# Altium project BMS_AFE.PrjPcb (part 2 of 3)

## Sheet BMS AFE - Communications.SchDoc: Title
size B; Organization: Midnight Sun Solar Rayce Car Team; Address1: University of Waterloo; Address2: 200 University Ave W; Address3: Waterloo, ON, Canada; Address4: N2L 3E9; DocumentNumber: 6; SheetNumber: 6; SheetTotal: 7; Website: www.uwmidsun.com; ProjectName: ProjectName
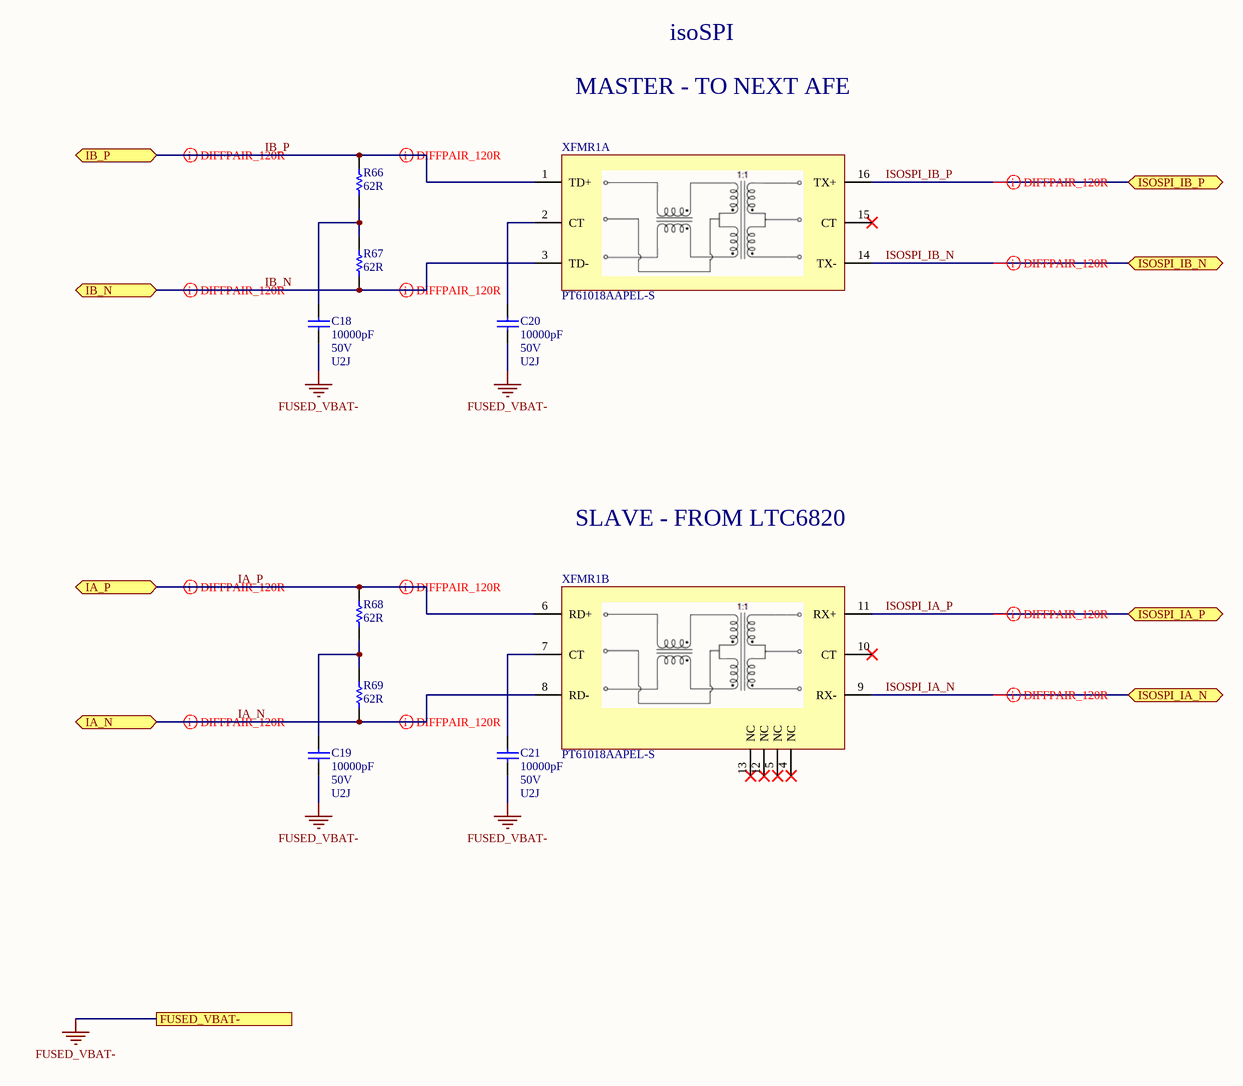
[diagram p4: BMS AFE - Communications.SchDoc]

### Parts
C18  Capacitance: 10000pF  Voltage: 50V  Temperature Coefficient: U2J  [CAP, 0603]  (hidden comment: CAP CER 10nF 50V 5% X7R 0603)
C19  Capacitance: 10000pF  Voltage: 50V  Temperature Coefficient: U2J  [CAP, 0603]  (hidden comment: CAP CER 10nF 50V 5% X7R 0603)
C20  Capacitance: 10000pF  Voltage: 50V  Temperature Coefficient: U2J  [CAP, 0603]  (hidden comment: CAP CER 10nF 50V 5% X7R 0603)
C21  Capacitance: 10000pF  Voltage: 50V  Temperature Coefficient: U2J  [CAP, 0603]  (hidden comment: CAP CER 10nF 50V 5% X7R 0603)
R66  62R  [RES, 0603]
R67  62R  [RES, 0603]
R68  62R  [RES, 0603]
R69  62R  [RES, 0603]
XFMR1  MFG_PN: PT61018AAPEL-S  [IC, PULSE XFMR 1CT:1CT 350UH SMD]  (hidden comment: IC PULSE XFMR 1CT:1CT 350UH SMD)  (parts A,B of 2)

### Ports
FUSED_VBAT-, IA_N (bidir), IA_P (bidir), IB_N (bidir), IB_P (bidir), ISOSPI_IA_N (bidir), ISOSPI_IA_P (bidir), ISOSPI_IB_N (bidir), ISOSPI_IB_P (bidir)

### Nets
FUSED_VBAT-: C18.2 C19.2 C20.2 C21.2 ; port FUSED_VBAT-
IA_N: R69.2 XFMR1.8(RD-) ; port IA_N
IA_P: R68.1 XFMR1.6(RD+) ; port IA_P
IB_N: R67.2 XFMR1.3(TD-) ; port IB_N
IB_P: R66.1 XFMR1.1(TD+) ; port IB_P
ISOSPI_IA_N: XFMR1.9(RX-) ; port ISOSPI_IA_N
ISOSPI_IA_P: XFMR1.11(RX+) ; port ISOSPI_IA_P
ISOSPI_IB_N: XFMR1.14(TX-) ; port ISOSPI_IB_N
ISOSPI_IB_P: XFMR1.16(TX+) ; port ISOSPI_IB_P
NetC18_1: C18.1 R66.2 R67.1
NetC19_1: C19.1 R68.2 R69.1
NetC20_1: C20.1 XFMR1.2(CT)
NetC21_1: C21.1 XFMR1.7(CT)

Not connected (* = marked no-connect by the designer): XFMR1 4(NC)* 5(NC)* 10(CT)* 12(NC)* 13(NC)* 15(CT)*

### Layout directives
differential pair: IA_N, IA_P, IB_N, IB_P, ISOSPI_IA_N, ISOSPI_IA_P, ISOSPI_IB_N, ISOSPI_IB_P

### Notes on the sheet
- MASTER - TO NEXT AFE
- isoSPI
- SLAVE - FROM LTC6820
- PROJECT
- DOCUMENT
- DRAWN BY
- LAST MODIFIED
- PART NUMBER
- REVISION
- SHEET
- VARIANT
- OF
- Engineering 5 - 1002
  University of Waterloo
  (519) 888-4567 x32978
  hardware@uwmidsun.com

### Library data of the parts
C18-C21 = CAP CER 10nF 50V 5% X7R 0603: 10000pF ±5% 50V Ceramic Capacitor U2J 0603 (1608 Metric); Manufacturer 1: KEMET; Manufacturer Part Number 1: C0603C103J5JAC7867; Supplier 1: Digi-Key; Supplier Part Number 1: 399-13384-1-ND; Packaging: Cut Tape (CT); Part Status: Active; Operating Temperature: -55°C ~ 125°C; Ratings: -; Failure Rate: -; Mounting Type: Surface Mount, MLCC; Package / Case: 0603 (1608 Metric); Size / Dimension: 0.063" L x 0.032" W (1.60mm x 0.80mm); Height - Seated (Max): -; Thickness (Max): 0.034" (0.87mm); Lead Spacing: -; Lead Style: -; ComponentLink1URL: http://www.kemet.com/docfinder?Partnumber=C0603C103J5JAC7867; ComponentLink1Description: http://www.kemet.com/docfinder?Partnumber=C0603C103J5JAC7867; Tolerance: ±5%
R66-R69 = RES 62 OHM 0.1% 1/10W 0603: 62 Ohms ±0.1% 0.1W, 1/10W Chip Resistor 0603 (1608 Metric) Automotive AEC-Q200 Thin Film; Manufacturer: Panasonic Electronic Components; Manufacturer Part Number: ERA-3AEB620V; Temperature Coefficient: ±25ppm/°C; Supplier 1: Digi-Key; RoHS: RoHS Compliant; Category: Resistors; Stock 1: 10320; Pricing 1: 1=0.52, 10=0.447, 100=0.1748, 1000=0.07317, 2500=0.06708 (CAD); Packaging: Cut Tape (CT); Part Status: Active; Tolerance: ±0.1%; Power (Watts): 0.1W, 1/10W; Composition: Thin Film; Features: Automotive AEC-Q200; Operating Temperature: -55°C ~ 155°C; Package / Case: 0603 (1608 Metric); Supplier Device Package: 0603; Size / Dimension: 0.063" L x 0.032" W (1.60mm x 0.80mm); Height - Seated (Max): 0.022" (0.55mm); Failure Rate: -; ComponentLink1URL: https://industrial.panasonic.com/cdbs/www-data/pdf/RDM0000/AOA0000C307.pdf; ComponentLink1Description: https://industrial.panasonic.com/cdbs/www-data/pdf/RDM0000/AOA0000C307.pdf; Supplier Part Number 1: P62DBCT-ND
XFMR1 = IC PULSE XFMR 1CT:1CT 350UH SMD: PULSE XFMR 1CT:1CT 350UH SMD; Manufacturer: Bourns Inc.; Isolation Voltage: 1.5kVrms; Supplier: Digikey; Supplier_PN: PT61018AAPEL-SCT-ND; Inductance: 350uH; Supplier 1: Digi-Key; Supplier Part Number 1: PT61018AAPEL-SCT-ND

## Sheet BMS AFE - Thermistors.SchDoc: Title
size B; Organization: Midnight Sun Solar Rayce Car Team; Address1: University of Waterloo; Address2: 200 University Ave W; Address3: Waterloo, ON, Canada; Address4: N2L 3E9; DocumentNumber: 7; SheetNumber: 7; SheetTotal: 7; Website: www.uwmidsun.com; ProjectName: ProjectName
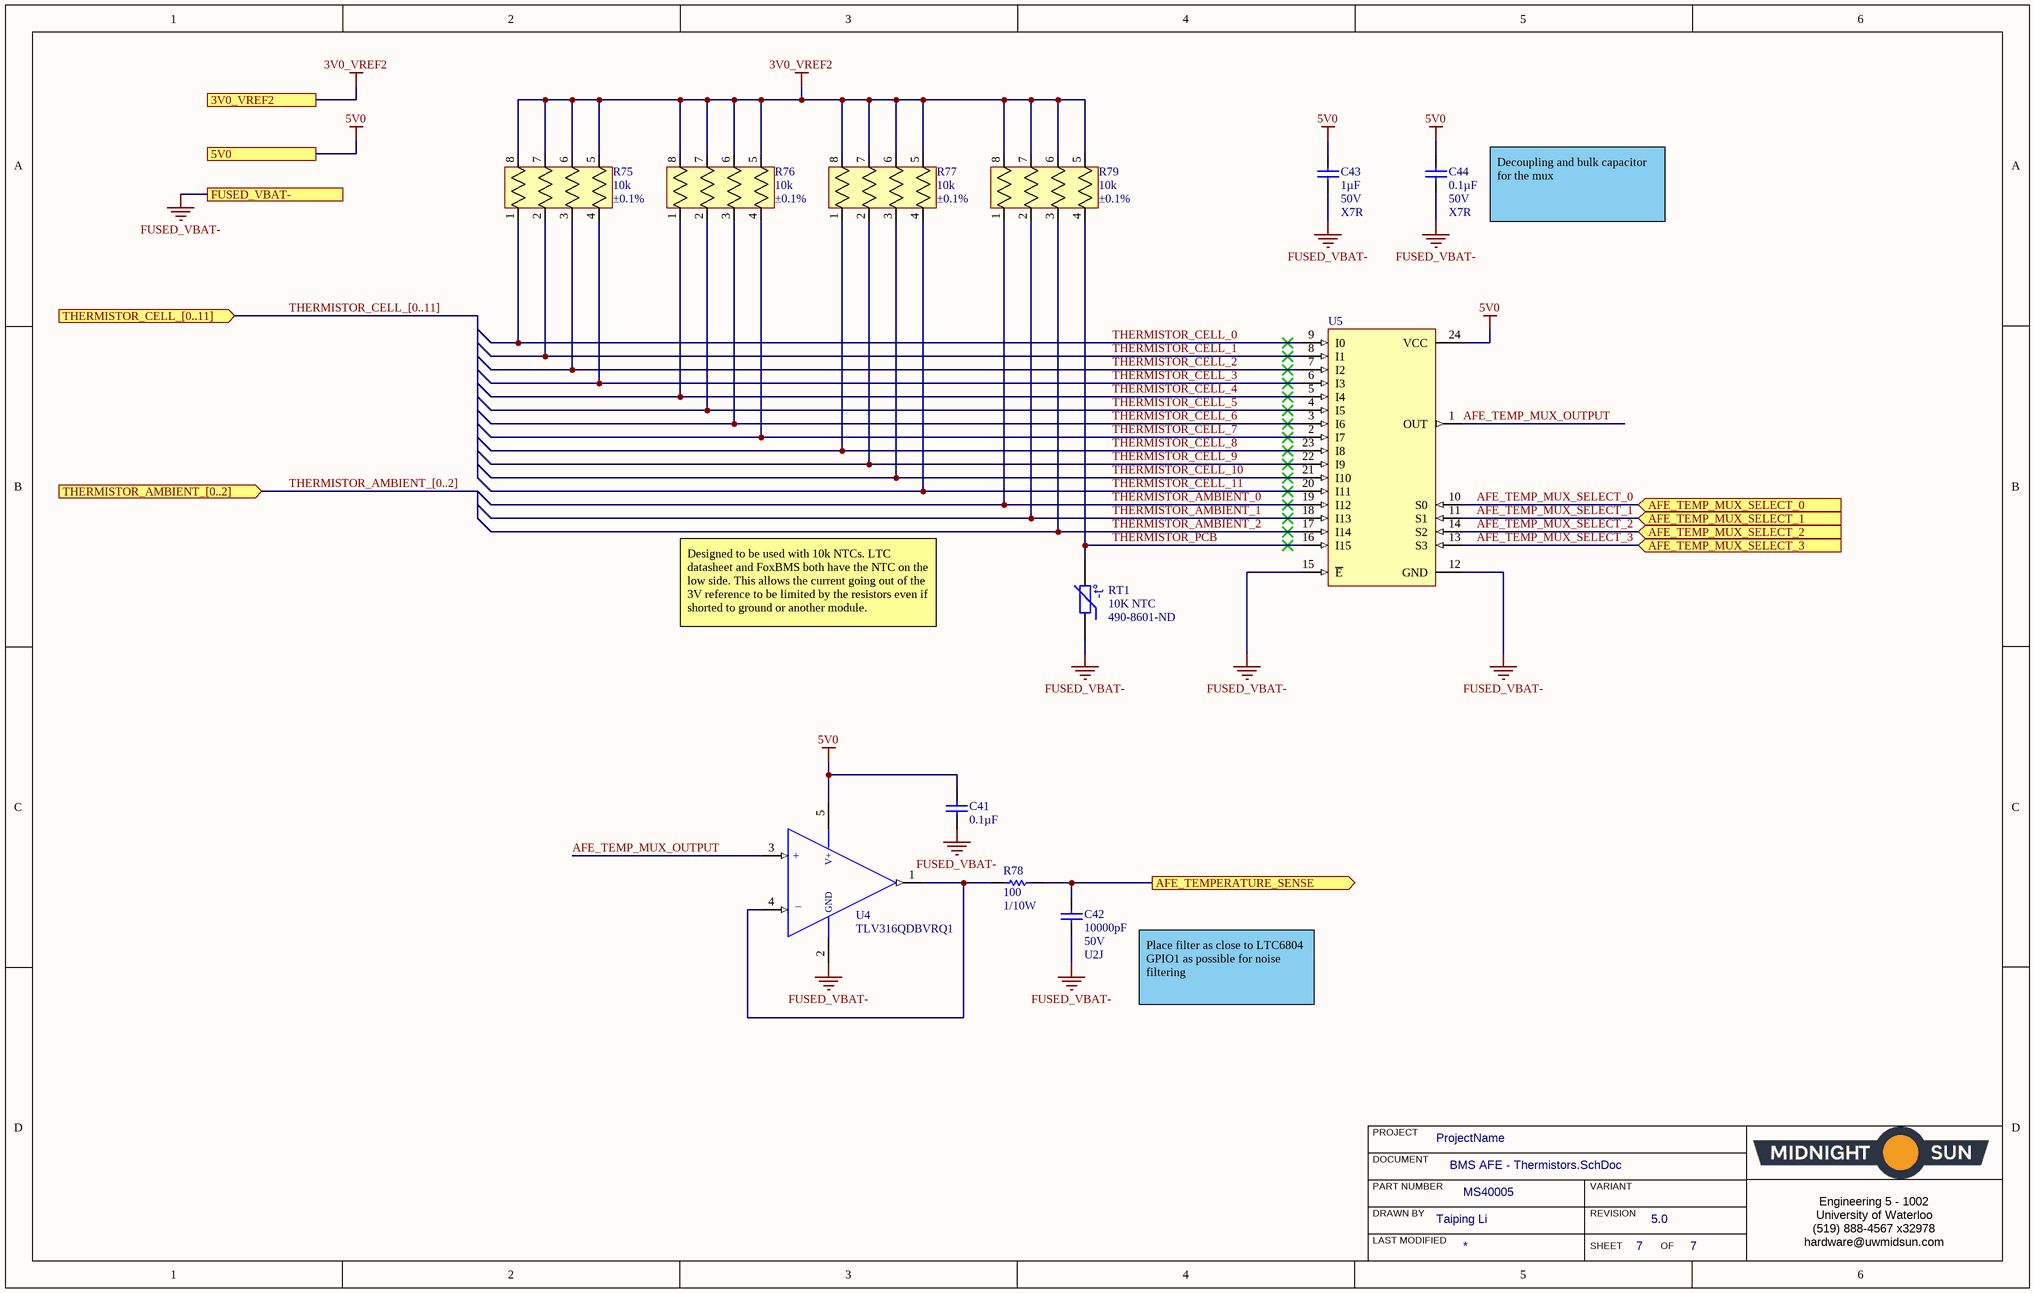
[diagram p5: BMS AFE - Thermistors.SchDoc]

### Parts
C41  Capacitance: 0.1µF  [CAP, 0603]  (hidden comment: CAP CER 0.1UF 50V 10% X7R 0603)
C42  Capacitance: 10000pF  Voltage: 50V  Temperature Coefficient: U2J  [CAP, 0603]  (hidden comment: CAP CER 10nF 50V 5% X7R 0603)
C43  Capacitance: 1µF  Voltage: 50V  Temperature Coefficient: X7R  [CAP, 0603]  (hidden comment: CAP CER 1UF 50V 10% X7R 0603)
C44  Capacitance: 0.1µF  Voltage: 50V  Temperature Coefficient: X7R  [CAP, 0603]  (hidden comment: CAP CER 0.1UF 50V 10% X7R 0603)
R75  Resistance (Ohms): 10k  Tolerance: ±0.1%  [RES ARRAY 4RES 1206]  (hidden comment: RES ARRAY 10K OHM 0.1% 4RES 1206)
R76  Resistance (Ohms): 10k  Tolerance: ±0.1%  [RES ARRAY 4RES 1206]  (hidden comment: RES ARRAY 10K OHM 0.1% 4RES 1206)
R77  Resistance (Ohms): 10k  Tolerance: ±0.1%  [RES ARRAY 4RES 1206]  (hidden comment: RES ARRAY 10K OHM 0.1% 4RES 1206)
R78  Resistance: 100  Power: 1/10W  [RES, 0603]  (hidden comment: RES 100 OHM 1% 1/10W 0603)
R79  Resistance (Ohms): 10k  Tolerance: ±0.1%  [RES ARRAY 4RES 1206]  (hidden comment: RES ARRAY 10K OHM 0.1% 4RES 1206)
RT1  10K NTC  Supplier Part Number 1: 490-8601-ND  [NTC THERMISTOR BEAD]
U4  Manufacturer Part Number 1: TLV316QDBVRQ1  [IC OP AMP GP RR 10MHZ SOT-23-5]  (hidden comment: IC OP AMP GEN PURPOSE RR 10MHZ SOT-23-5)
U5  IC MUX/DEMUX 1X16 24SSOP  [SOP127P1030X265-24N]  (value not drawn)

### Ports
3V0_VREF2, 5V0, AFE_TEMP_MUX_SELECT_0 (in), AFE_TEMP_MUX_SELECT_1 (in), AFE_TEMP_MUX_SELECT_2 (in), AFE_TEMP_MUX_SELECT_3 (in), AFE_TEMPERATURE_SENSE (out), FUSED_VBAT-, THERMISTOR_AMBIENT_[0..2] (in), THERMISTOR_CELL_[0..11] (in)

### Nets
3V0_VREF2: R75.5 R75.6 R75.7 R75.8 R76.5 R76.6 R76.7 R76.8 R77.5 R77.6 R77.7 R77.8 R79.5 R79.6 R79.7 R79.8 ; port 3V0_VREF2
5V0: C41.1 C43.1 C44.1 U4.5(VDD) U5.24(VCC) ; port 5V0
FUSED_VBAT-: C41.2 C42.2 C43.2 C44.2 RT1.1 U4.2(VSS) U5.12(GND) U5.15(~{E}) ; port FUSED_VBAT-
AFE_TEMP_MUX_OUTPUT: U4.3(+IN) U5.1(OUT)
AFE_TEMP_MUX_SELECT_0: U5.10(S0) ; port AFE_TEMP_MUX_SELECT_0
AFE_TEMP_MUX_SELECT_1: U5.11(S1) ; port AFE_TEMP_MUX_SELECT_1
AFE_TEMP_MUX_SELECT_2: U5.14(S2) ; port AFE_TEMP_MUX_SELECT_2
AFE_TEMP_MUX_SELECT_3: U5.13(S3) ; port AFE_TEMP_MUX_SELECT_3
THERMISTOR_AMBIENT_0: R79.1 U5.19(I12)
THERMISTOR_AMBIENT_1: R79.2 U5.18(I13)
THERMISTOR_AMBIENT_2: R79.3 U5.17(I14)
THERMISTOR_CELL_0: R75.1 U5.9(I0)
THERMISTOR_CELL_1: R75.2 U5.8(I1)
THERMISTOR_CELL_2: R75.3 U5.7(I2)
THERMISTOR_CELL_3: R75.4 U5.6(I3)
THERMISTOR_CELL_4: R76.1 U5.5(I4)
THERMISTOR_CELL_5: R76.2 U5.4(I5)
THERMISTOR_CELL_6: R76.3 U5.3(I6)
THERMISTOR_CELL_7: R76.4 U5.2(I7)
THERMISTOR_CELL_8: R77.1 U5.23(I8)
THERMISTOR_CELL_9: R77.2 U5.22(I9)
THERMISTOR_CELL_10: R77.3 U5.21(I10)
THERMISTOR_CELL_11: R77.4 U5.20(I11)
THERMISTOR_PCB: R79.4 RT1.2 U5.16(I15)
NetC42_1: C42.1 R78.2 ; port AFE_TEMPERATURE_SENSE
NetR78_1: R78.1 U4.1(OUTPUT) U4.4(-IN)

### Buses and harness runs
bus THERMISTOR_AMBIENT_[0..2] = port THERMISTOR_AMBIENT_[0..2]
bus THERMISTOR_CELL_[0..11] = port THERMISTOR_CELL_[0..11]

### Notes on the sheet
- Decoupling and bulk capacitor for the mux
- Designed to be used with 10k NTCs. LTC datasheet and FoxBMS both have the NTC on the low side. This allows the current going out of the 3V reference to be limited by the resistors even if shorted to ground or another module.
- Place filter as close to LTC6804 GPIO1 as possible for noise filtering
- PROJECT
- DOCUMENT
- DRAWN BY
- LAST MODIFIED
- PART NUMBER
- REVISION
- SHEET
- VARIANT
- OF
- Engineering 5 - 1002
  University of Waterloo
  (519) 888-4567 x32978
  hardware@uwmidsun.com
- (in symbol IC OP AMP GEN PURPOSE RR 10MHZ SOT-23-5) V+; +; GND; _
- (in symbol NTC THERMISTOR 10K 1% BEAD) -t°

### Library data of the parts
C41 C44 = CAP CER 0.1UF 50V 10% X7R 0603: 0.10µF ±10% 50V Ceramic Capacitor X7R 0603 (1608 Metric); Manufacturer 1: AVX Corporation; Manufacturer Part Number 1: 06035C104KAT2A; Supplier 1: Digi-Key; Supplier Part Number 1: 478-5052-1-ND; Packaging: Cut Tape (CT); Part Status: Active; Operating Temperature: -55°C ~ 125°C; Ratings: -; Mounting Type: Surface Mount, MLCC; Package / Case: 0603 (1608 Metric); Size / Dimension: 0.063" L x 0.032" W (1.60mm x 0.81mm); Height - Seated (Max): -; Thickness (Max): 0.035" (0.90mm); Lead Spacing: -; Lead Style: -; ComponentLink1URL: http://datasheets.avx.com/X7RDielectric.pdf; ComponentLink1Description: http://datasheets.avx.com/X7RDielectric.pdf; Tolerance: ±10%
  C41: Voltage: 50V; Temperature Coefficient: X7R
C42 = CAP CER 10nF 50V 5% X7R 0603: as C18 on sheet BMS AFE - Communications; Supplier 1: Digi-Key; Supplier Part Number 1: 399-13384-1-ND; Packaging: Cut Tape (CT); Part Status: Active; Operating Temperature: -55°C ~ 125°C; Ratings: -; Failure Rate: -; Mounting Type: Surface Mount, MLCC; Package / Case: 0603 (1608 Metric); Size / Dimension: 0.063" L x 0.032" W (1.60mm x 0.80mm); Height - Seated (Max): -; Thickness (Max): 0.034" (0.87mm); Lead Spacing: -; Lead Style: -; ComponentLink1URL: http://www.kemet.com/docfinder?Partnumber=C0603C103J5JAC7867; ComponentLink1Description: http://www.kemet.com/docfinder?Partnumber=C0603C103J5JAC7867; Tolerance: ±5%
C43 = CAP CER 1UF 50V 10% X7R 0603: as C2 on sheet BMS AFE - AFE; Supplier 1: Digi-Key; Supplier Part Number 1: 587-3247-1-ND; Packaging: Cut Tape (CT); Part Status: Active; Operating Temperature: -55°C ~ 125°C; Ratings: -; Mounting Type: Surface Mount, MLCC; Package / Case: 0603 (1608 Metric); Size / Dimension: 0.063" L x 0.031" W (1.60mm x 0.80mm); Height - Seated (Max): -; Thickness (Max): 0.037" (0.95mm); Lead Spacing: -; Lead Style: -; ComponentLink1URL: http://www.yuden.co.jp/productdata/catalog/en/mlcc_all_e.pdf; ComponentLink1Description: http://www.yuden.co.jp/productdata/catalog/en/mlcc_all_e.pdf; Tolerance: ±10%
R75-R77 R79 = RES ARRAY 10K OHM 0.1% 4RES 1206: 10k Ohm ±0.1% 100mW Power Per Element Isolated 4 Resistor Network/Array ±25ppm/°C 1206 (3216 Metric), Convex, Long Side Terminals; Manufacturer: Vishay Beyschlag; Manufacturer Part Number: ACASA1002S1002P100; Number of Resistors: 4; Resistor Matching Ratio: ±0.05%; Resistor-Ratio-Drift: ±15 ppm/°C; Supplier 1: Digi-Key; RoHS: RoHS Compliant; Category: Resistors; Stock 1: 18780; Pricing 1: 1=1.19, 10=0.99, 25=0.8484, 50=0.7636, 100=0.6647, 250=0.59392, 500=0.4808 (CAD); Packaging: Cut Tape (CT); Part Status: Active; Circuit Type: Isolated; Power Per Element: 100mW; Temperature Coefficient: ±25ppm/°C; Operating Temperature: -55°C ~ 125°C; Applications: Voltage Divider (TCR Matched); Mounting Type: Surface Mount; Package / Case: 1206 (3216 Metric), Convex, Long Side Terminals; Supplier Device Package: 0612; Size / Dimension: 0.126" L x 0.059" W (3.20mm x 1.50mm); Height - Seated (Max): 0.022" (0.55mm); ComponentLink1URL: http://www.vishay.com/docs/28751/acasprec.pdf; ComponentLink1Description: http://www.vishay.com/docs/28751/acasprec.pdf; Supplier Part Number 1: 749-1023-1-ND
R78 = RES 100 OHM 1% 1/10W 0603: 100 Ohm ±1% 0.1W, 1/10W Chip Resistor 0603 (1608 Metric) Moisture Resistant Thick Film; Manufacturer 1: Yageo; Manufacturer Part Number 1: RC0603FR-07100RL; Temperature Coefficient: ±100ppm/°C; Supplier 1: Digi-Key; Supplier Part Number 1: 311-100HRCT-ND; Packaging: Cut Tape (CT); Part Status: Active; Composition: Thick Film; Operating Temperature: -55°C ~ 155°C; Package / Case: 0603 (1608 Metric); Supplier Device Package: 0603; Size / Dimension: 0.063" L x 0.031" W (1.60mm x 0.80mm); Height - Seated (Max): 0.022" (0.55mm); Failure Rate: -; ComponentLink1URL: http://www.yageo.com/documents/recent/PYu-RC_Group_51_RoHS_L_7.pdf; ComponentLink1Description: http://www.yageo.com/documents/recent/PYu-RC_Group_51_RoHS_L_7.pdf; Tolerance: ±1%
RT1 = NTC THERMISTOR 10K 1% BEAD: NTC Thermistor 10k Bead; Manufacturer: Murata Electronics North America; Manufacturer Part Number: NXRT15XH103FA1B030; Resistance Tolerance: ±1%; B25/50: 3380K; B25/85: 3434K; B25/100: 3455K; Supplier 1: Digi-Key; RoHS: RoHS Compliant; Category: Sensors, Transducers; Stock 1: 25017; Pricing 1: 1=0.96, 5=0.91, 10=0.792, 25=0.696, 50=0.5784, 100=0.4925, 500=0.42834, 1000=0.3748, 5000=0.33197 (CAD); Packaging: Bulk; Part Status: Active; Resistance in Ohms @ 25°C: 10k; B Value Tolerance: ±1%; B0/50: -; B25/75: -; Operating Temperature: -40°C ~ 125°C; Length - Lead Wire: -; Mounting Type: Through Hole; Package / Case: Bead; ComponentLink1URL: https://www.murata.com/~/media/webrenewal/support/library/catalog/products/thermistor/ntc/r44e.ashx; ComponentLink1Description: https://www.murata.com/~/media/webrenewal/support/library/catalog/products/thermistor/ntc/r44e.ashx
U4 = IC OP AMP GEN PURPOSE RR 10MHZ SOT-23-5: General Purpose Amplifier 1 Circuit Rail-to-Rail SOT-23-5; Manufacturer 1: Texas Instruments; Description 1: IC OP AMP GP RR 10MHZ 5-SOT-23; Number of Circuits: 1; Slew Rate: 6 V/µs; Current - Supply: 400µA; Current - Output / Channel: 50mA; Voltage - Supply, Single/Dual (±): 1.8 V ~ 5.5 V, ±0.9 V ~ 2.75 V; Supplier 1: Digi-Key; Supplier Part Number 1: 296-45323-1-ND; RoHS: RoHS Compliant; Category: Integrated Circuits (ICs); Stock 1: 1747; Pricing 1: 1=1.33, 10=1.185, 100=0.9234, 500=0.76276, 1000=0.60218 (CAD); Packaging: Cut Tape (CT); Part Status: Active; Amplifier Type: General Purpose; Output Type: Rail-to-Rail; -3db Bandwidth: -; Operating Temperature: -40°C ~ 125°C; Mounting Type: Surface Mount; Package / Case: SC-74A, SOT-753; Supplier Device Package: SOT-23-5; ComponentLink1URL: http://www.ti.com/lit/ds/symlink/tlv316-q1.pdf; ComponentLink1Description: http://www.ti.com/lit/ds/symlink/tlv316-q1.pdf
U5 = IC MUX/DEMUX 1X16 24SSOP: 1 Circuit IC Switch 16:1 160 Ohm 24-SOIC; Manufacturer: Texas Instruments; Manufacturer Part Number: CD74HC4067M96; Number of Circuits: 1; Number of Inputs: 16; Max Supply Voltage: 6V; Min Supply Voltage: 2V; Bandwidth: 89MHz; Propagation Delay: 75ns; On-State Resistance: 180R; Turn-On Delay Time: 300ns; Turn-Off Delay Time: 290ns; Logic Function: Demultiplexer,Multiplexer; Operating Supply Current: 8uA; Supply Type: Single; Low Level Output Current: 25mA; Supplier 1: Digi-Key; Supplier Part Number 1: 296-29408-1-ND; Packaging: Tape and Reel; ComponentLink1URL: http://www.ti.com/lit/ds/symlink/cd74hc4067.pdf; ComponentLink1Description: http://www.ti.com/lit/ds/symlink/cd74hc4067.pdf; Stock 1: 10305; Pricing 1: 1 = 0.80000, 10 = 0.70400, 100 = 0.53940, 500 = 0.42642, 1000 = 0.34114 (USD); RoHS: Yes; Mount: Surface Mount; Case/Package: SOIC; Number of Pins: 24; Weight: 0.022025oz; Contact Plating: Matte,Tin; Min Operating Temperature: -55°C; Max Operating Temperature: 125°C; Number of Channels: 1; Number of Outputs: 1; Package Quantity: 2000; Nominal Supply Current: 8uA; Number of Bits: 16; High Level Output Current: 25mA; Length: 15.4mm; Height: 2.35mm; Width: 7.52mm; Radiation Hardening: No; REACH SVHC: No SVHC; Lead Free: Lead Free; ComponentLink2URL: https://www.verical.com/server-webapp/html/getDatasheet?partID=322813&src-supplier=Verical; ComponentLink2Description: https://www.verical.com/server-webapp/html/getDatasheet?partID=322813&src-supplier=Verical; ComponentLink3URL: http://focus.ti.com/lit/ds/symlink/cd74hc4067.pdf?src-supplier=Avnet+Europe; ComponentLink3Description: http://focus.ti.com/lit/ds/symlink/cd74hc4067.pdf?src-supplier=Avnet+Europe; ComponentLink4URL: http://www.ti.com/lit/ds/symlink/cd74hc4067.pdf?src-supplier=Digi-Key; ComponentLink4Description: http://www.ti.com/lit/ds/symlink/cd74hc4067.pdf?src-supplier=Digi-Key

## Sheet BMS AFE - Connectors.SchDoc: Title
size B; Organization: Midnight Sun Solar Rayce Car Team; Address1: University of Waterloo; Address2: 200 University Ave W; Address3: Waterloo, ON, Canada; Address4: N2L 3E9; DocumentNumber: 2; SheetNumber: 2; SheetTotal: 7; Website: www.uwmidsun.com; ProjectName: ProjectName
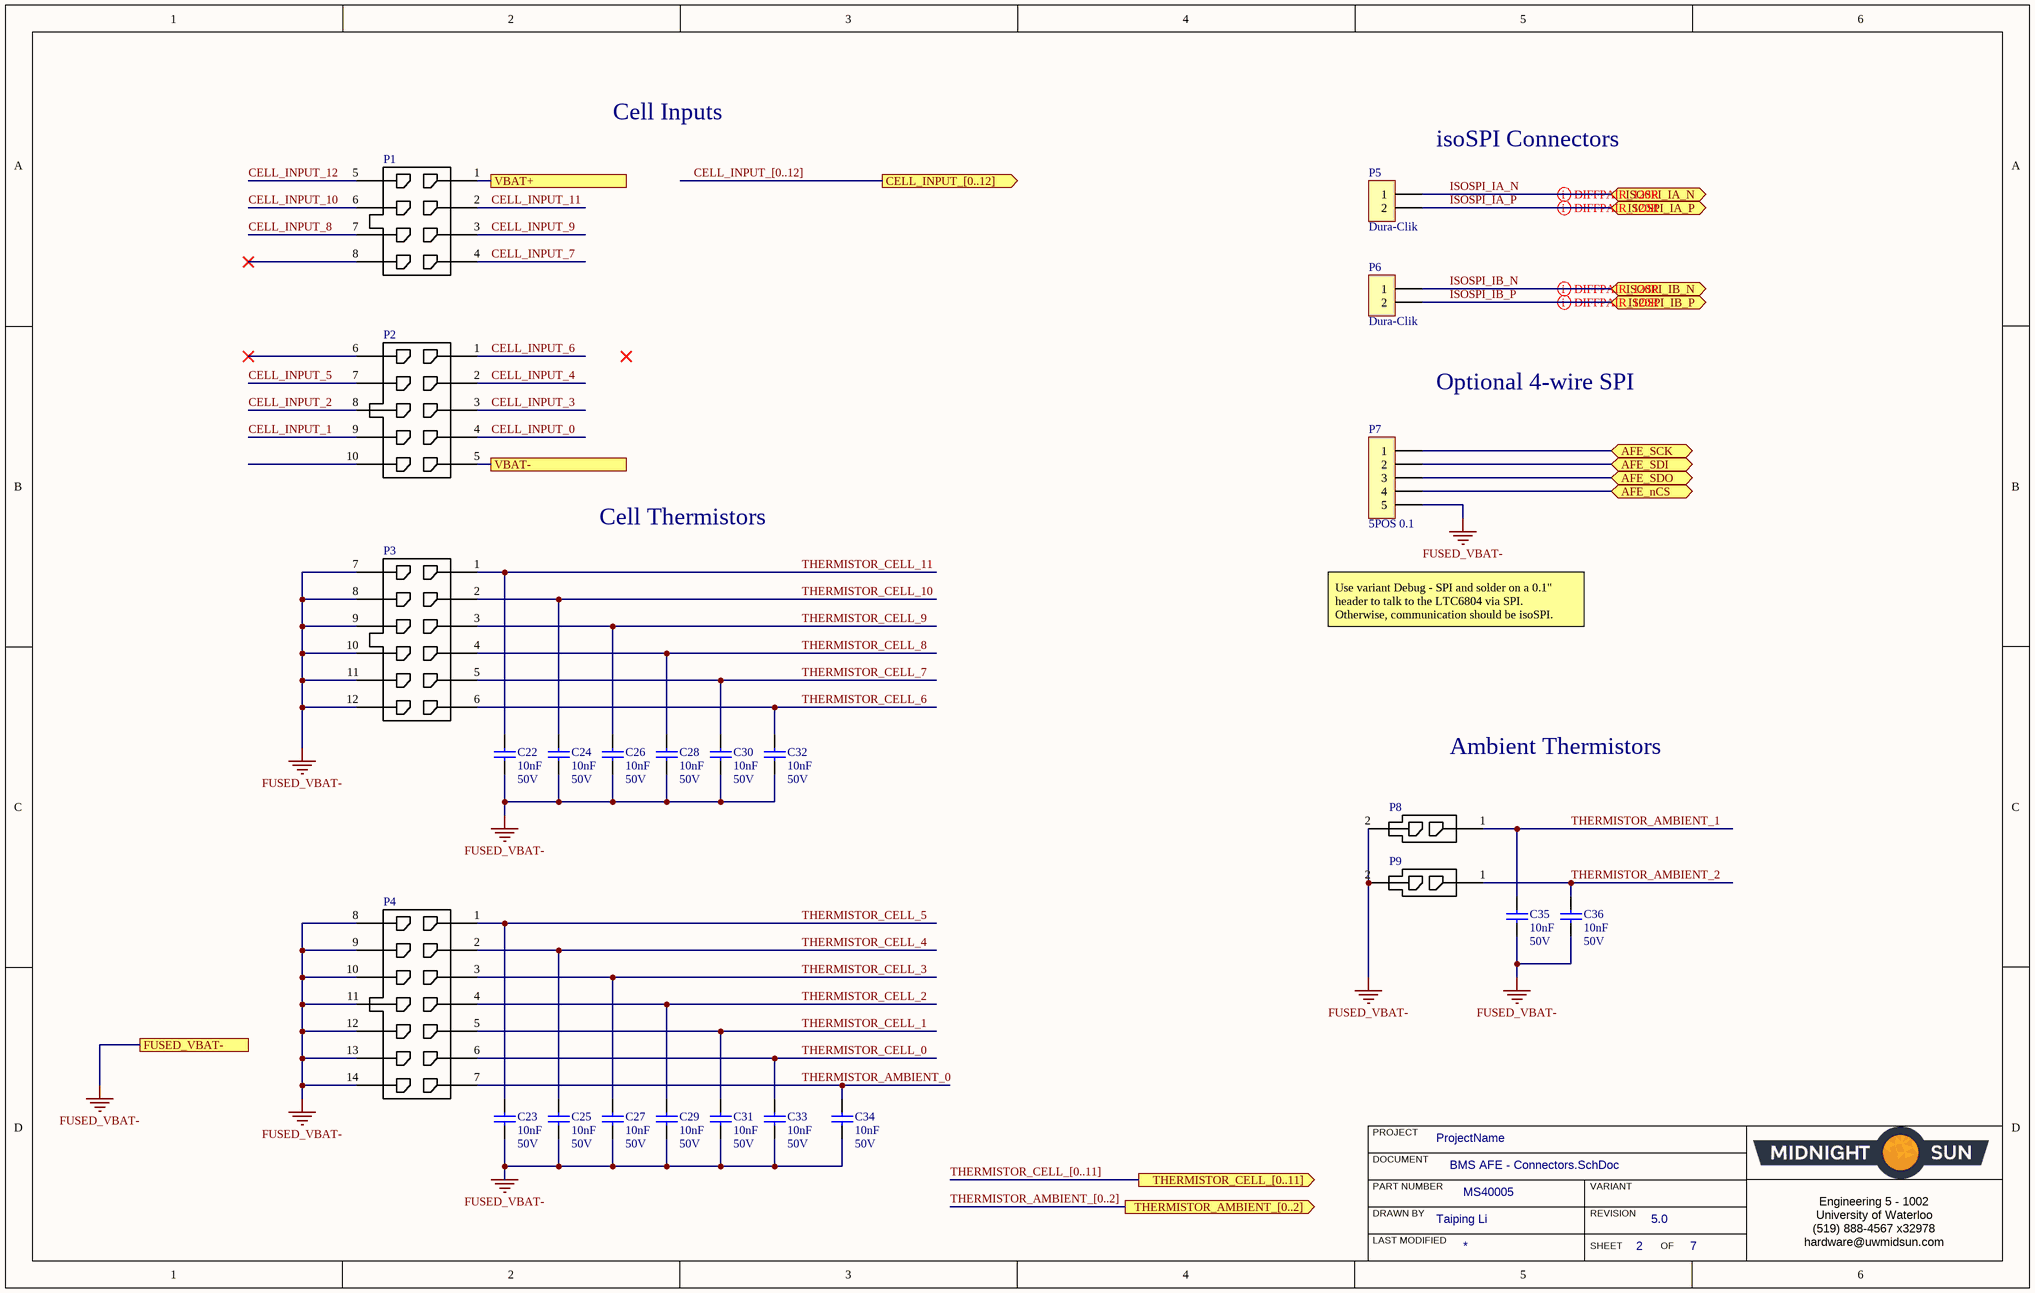
[diagram p6: BMS AFE - Connectors.SchDoc]

### Parts
C22  Capacitance: 10nF  Voltage: 50V  [CAP, 0603]  (hidden comment: CAP CER 10nF 50V 5% X7R 0603)
C23  Capacitance: 10nF  Voltage: 50V  [CAP, 0603]  (hidden comment: CAP CER 10nF 50V 5% X7R 0603)
C24  Capacitance: 10nF  Voltage: 50V  [CAP, 0603]  (hidden comment: CAP CER 10nF 50V 5% X7R 0603)
C25  Capacitance: 10nF  Voltage: 50V  [CAP, 0603]  (hidden comment: CAP CER 10nF 50V 5% X7R 0603)
C26  Capacitance: 10nF  Voltage: 50V  [CAP, 0603]  (hidden comment: CAP CER 10nF 50V 5% X7R 0603)
C27  Capacitance: 10nF  Voltage: 50V  [CAP, 0603]  (hidden comment: CAP CER 10nF 50V 5% X7R 0603)
C28  Capacitance: 10nF  Voltage: 50V  [CAP, 0603]  (hidden comment: CAP CER 10nF 50V 5% X7R 0603)
C29  Capacitance: 10nF  Voltage: 50V  [CAP, 0603]  (hidden comment: CAP CER 10nF 50V 5% X7R 0603)
C30  Capacitance: 10nF  Voltage: 50V  [CAP, 0603]  (hidden comment: CAP CER 10nF 50V 5% X7R 0603)
C31  Capacitance: 10nF  Voltage: 50V  [CAP, 0603]  (hidden comment: CAP CER 10nF 50V 5% X7R 0603)
C32  Capacitance: 10nF  Voltage: 50V  [CAP, 0603]  (hidden comment: CAP CER 10nF 50V 5% X7R 0603)
C33  Capacitance: 10nF  Voltage: 50V  [CAP, 0603]  (hidden comment: CAP CER 10nF 50V 5% X7R 0603)
C34  Capacitance: 10nF  Voltage: 50V  [CAP, 0603]  (hidden comment: CAP CER 10nF 50V 5% X7R 0603)
C35  Capacitance: 10nF  Voltage: 50V  [CAP, 0603]  (hidden comment: CAP CER 10nF 50V 5% X7R 0603)
C36  Capacitance: 10nF  Voltage: 50V  [CAP, 0603]  (hidden comment: CAP CER 10nF 50V 5% X7R 0603)
P1  CONN 8POS MICRO-FIT 3mm  (value not drawn)
P2  CONN 10POS MICRO-FIT 3mm  [CONN, 10POS MICRO-FIT 3mm]  (value not drawn)
P3  CONN 12POS MICRO-FIT 3mm  [CONN, 12POS MICRO-FIT 3mm]  (value not drawn)
P4  CONN 14POS MICRO-FIT 3mm  [CONN, 14POS MICRO-FIT 3mm]  (value not drawn)
P5  Dura-Clik  [CONN, 2POS Dura-Click Vertical]
P6  Dura-Clik  [CONN, 2POS Dura-Click Vertical]
P7  5POS 0.1  [CONN, 5POS HEADR 0.1"]
P8  CONN 2POS MICRO-FIT 3mm  [CONN, 2POS MICRO-FIT]  (value not drawn)
P9  CONN 2POS MICRO-FIT 3mm  [CONN, 2POS MICRO-FIT]  (value not drawn)

### Ports
AFE_nCS (bidir), AFE_SCK (bidir), AFE_SDI (bidir), AFE_SDO (bidir), CELL_INPUT_[0..12] (out), FUSED_VBAT-, ISOSPI_IA_N (bidir), ISOSPI_IA_P (bidir), ISOSPI_IB_N (bidir), ISOSPI_IB_P (bidir), THERMISTOR_AMBIENT_[0..2] (out), THERMISTOR_CELL_[0..11] (out), VBAT+, VBAT-

### Nets
FUSED_VBAT-: C22.2 C23.2 C24.2 C25.2 C26.2 C27.2 C28.2 C29.2 C30.2 C31.2 C32.2 C33.2 C34.2 C35.2 C36.2 P3.7 P3.8 P3.9 P3.10 P3.11 P3.12 P4.8 P4.9 P4.10 P4.11 P4.12 P4.13 P4.14 P7.5 P8.2 P9.2 ; port FUSED_VBAT-
CELL_INPUT_0: P2.4
CELL_INPUT_1: P2.9
CELL_INPUT_2: P2.8
CELL_INPUT_3: P2.3
CELL_INPUT_4: P2.2
CELL_INPUT_5: P2.7
CELL_INPUT_6: P2.1
CELL_INPUT_7: P1.4
CELL_INPUT_8: P1.7
CELL_INPUT_9: P1.3
CELL_INPUT_10: P1.6
CELL_INPUT_11: P1.2
CELL_INPUT_12: P1.5
ISOSPI_IA_N: P5.1 ; port ISOSPI_IA_N
ISOSPI_IA_P: P5.2 ; port ISOSPI_IA_P
ISOSPI_IB_N: P6.1 ; port ISOSPI_IB_N
ISOSPI_IB_P: P6.2 ; port ISOSPI_IB_P
THERMISTOR_AMBIENT_0: C34.1 P4.7
THERMISTOR_AMBIENT_1: C35.1 P8.1
THERMISTOR_AMBIENT_2: C36.1 P9.1
THERMISTOR_CELL_0: C33.1 P4.6
THERMISTOR_CELL_1: C31.1 P4.5
THERMISTOR_CELL_2: C29.1 P4.4
THERMISTOR_CELL_3: C27.1 P4.3
THERMISTOR_CELL_4: C25.1 P4.2
THERMISTOR_CELL_5: C23.1 P4.1
THERMISTOR_CELL_6: C32.1 P3.6
THERMISTOR_CELL_7: C30.1 P3.5
THERMISTOR_CELL_8: C28.1 P3.4
THERMISTOR_CELL_9: C26.1 P3.3
THERMISTOR_CELL_10: C24.1 P3.2
THERMISTOR_CELL_11: C22.1 P3.1
NetF1_1: P2.5 ; port VBAT-
NetF2_1: P1.1 ; port VBAT+
NetP7_1: P7.1 ; port AFE_SCK
NetP7_2: P7.2 ; port AFE_SDI
NetP7_3: P7.3 ; port AFE_SDO
NetP7_4: P7.4 ; port AFE_nCS

Not connected (* = marked no-connect by the designer): P1 8*; P2 6* 10

### Buses and harness runs
bus CELL_INPUT_[0..12] = port CELL_INPUT_[0..12]
bus THERMISTOR_AMBIENT_[0..2] = port THERMISTOR_AMBIENT_[0..2]
bus THERMISTOR_CELL_[0..11] = port THERMISTOR_CELL_[0..11]

### Layout directives
differential pair: ISOSPI_IA_N, ISOSPI_IA_P, ISOSPI_IB_N, ISOSPI_IB_P

### Notes on the sheet
- Cell Inputs
- isoSPI Connectors
- Optional 4-wire SPI
- Cell Thermistors
- Use variant Debug - SPI and solder on a 0.1" header to talk to the LTC6804 via SPI. Otherwise, communication should be isoSPI.
- Ambient Thermistors
- PROJECT
- DOCUMENT
- DRAWN BY
- LAST MODIFIED
- PART NUMBER
- REVISION
- SHEET
- VARIANT
- OF
- Engineering 5 - 1002
  University of Waterloo
  (519) 888-4567 x32978
  hardware@uwmidsun.com

### Library data of the parts
C22-C36 = CAP CER 10nF 50V 5% X7R 0603: as C18 on sheet BMS AFE - Communications; Supplier 1: Digi-Key; Supplier Part Number 1: 399-13384-1-ND; Packaging: Cut Tape (CT); Part Status: Active; Operating Temperature: -55°C ~ 125°C; Ratings: -; Failure Rate: -; Mounting Type: Surface Mount, MLCC; Package / Case: 0603 (1608 Metric); Size / Dimension: 0.063" L x 0.032" W (1.60mm x 0.80mm); Height - Seated (Max): -; Thickness (Max): 0.034" (0.87mm); Lead Spacing: -; Lead Style: -; ComponentLink1URL: http://www.kemet.com/docfinder?Partnumber=C0603C103J5JAC7867; ComponentLink1Description: http://www.kemet.com/docfinder?Partnumber=C0603C103J5JAC7867; Tolerance: ±5%; Temperature Coefficient: U2J
P1 = CONN 8POS MICRO-FIT 3mm: Connector Header Through Hole 6 position 0.118" (3.00mm); Manufacturer: Molex, LLC; Manufacturer Part Number: 0430450827; Number of Positions: 6; Number of Positions Loaded: All; Style: Board to Cable/Wire; Shrouding: Shrouded - 4 Wall; Contact Length - Post: 0.125" (3.18mm); Material Flammability Rating: UL94 V-0; RoHS: RoHS Compliant; Category: Connectors, Interconnects; Packaging: Tray; Part Status: Active; Connector Type: Header; Contact Type: Male Pin; Pitch - Mating: 0.118" (3.00mm); Number of Rows: 2; Row Spacing - Mating: 0.118" (3.00mm); Mounting Type: Through Hole; Termination: Solder; Fastening Type: Locking Ramp; Contact Length - Mating: -; Overall Contact Length: -; Insulation Height: 0.390" (9.91mm); Contact Shape: Square; Contact Finish - Mating: Tin; Contact Finish Thickness - Mating: 60.0µin (1.52µm); Contact Finish - Post: Tin; Contact Material: Brass; Insulation Material: Liquid Crystal Polymer (LCP), Glass Filled; Features: Board Guide; Operating Temperature: -; Ingress Protection: -; Insulation Color: Black; Current Rating: -; Voltage Rating: -; Mated Stacking Heights: -; Contact Finish Thickness - Post: -; Applications: General Purpose, Medical, Military, Telecommunications; ComponentLink1URL: https://www.molex.com/pdm_docs/sd/430450627_sd.pdf; ComponentLink1Description: https://www.molex.com/pdm_docs/sd/430450627_sd.pdf; Supplier 1: Digi-Key; Stock 1: 5553; Pricing 1: 1=2.69, 10=2.445, 25=2.2964, 50=2.1964, 100=2.0965, 250=1.8968, 500=1.74704, 1440=1.49746, 2880=1.39763 (CAD); ComponentLink2URL: https://www.molex.com/pdm_docs/sd/430450827_sd.pdf; ComponentLink2Description: https://www.molex.com/pdm_docs/sd/430450827_sd.pdf; Supplier Part Number 1: WM10684-ND
P2 = CONN 10POS MICRO-FIT 3mm: Connector Header Through Hole 10 position 0.118" (3.00mm); Manufacturer: Molex, LLC; Manufacturer Part Number: 0430451027; Number of Positions: 10; Number of Positions Loaded: All; Style: Board to Cable/Wire; Shrouding: Shrouded - 4 Wall; Contact Length - Post: 0.125" (3.18mm); Material Flammability Rating: UL94 V-0; Supplier 1: Digi-Key; RoHS: RoHS Compliant; Category: Connectors, Interconnects; Stock 1: 8114; Pricing 1: 1=3.15, 10=2.864, 100=2.455, 500=2.0458, 1224=1.75355, 6120=1.55481 (CAD); Packaging: Tray; Part Status: Active; Connector Type: Header; Contact Type: Male Pin; Pitch - Mating: 0.118" (3.00mm); Number of Rows: 2; Row Spacing - Mating: 0.118" (3.00mm); Mounting Type: Through Hole; Termination: Solder; Fastening Type: Locking Ramp; Contact Length - Mating: -; Overall Contact Length: -; Insulation Height: 0.390" (9.91mm); Contact Shape: Square; Contact Finish - Mating: Tin; Contact Finish Thickness - Mating: 60.0µin (1.52µm); Contact Finish - Post: Tin; Contact Material: Brass; Insulation Material: Liquid Crystal Polymer (LCP), Glass Filled; Features: Board Guide; Operating Temperature: -; Ingress Protection: -; Insulation Color: Black; Current Rating: -; Voltage Rating: -; Mated Stacking Heights: -; Contact Finish Thickness - Post: -; Applications: General Purpose, Medical, Military, Telecommunications; ComponentLink1URL: https://www.molex.com/pdm_docs/sd/430451027_sd.pdf; ComponentLink1Description: https://www.molex.com/pdm_docs/sd/430451027_sd.pdf; Supplier Part Number 1: WM7488-ND
P3 = CONN 12POS MICRO-FIT 3mm: Connector Header Through Hole 12 position 0.118" (3.00mm); Manufacturer: Molex, LLC; Manufacturer Part Number: 0430451227; Number of Positions: 12; Number of Positions Loaded: All; Style: Board to Cable/Wire; Shrouding: Shrouded - 4 Wall; Contact Length - Post: 0.125" (3.18mm); Material Flammability Rating: UL94 V-0; Supplier 1: Digi-Key; RoHS: RoHS Compliant; Category: Connectors, Interconnects; Stock 1: 1709; Pricing 1: 1=3.61, 10=3.283, 25=3.0816, 50=2.9478, 100=2.8138, 250=2.5458, 500=2.34482, 1008=2.00985, 3024=1.87586 (CAD); Packaging: Tray; Part Status: Active; Connector Type: Header; Contact Type: Male Pin; Pitch - Mating: 0.118" (3.00mm); Number of Rows: 2; Row Spacing - Mating: 0.118" (3.00mm); Mounting Type: Through Hole; Termination: Solder; Fastening Type: Locking Ramp; Contact Length - Mating: -; Overall Contact Length: -; Insulation Height: 0.390" (9.91mm); Contact Shape: Square; Contact Finish - Mating: Tin; Contact Finish Thickness - Mating: 60.0µin (1.52µm); Contact Finish - Post: Tin; Contact Material: Brass; Insulation Material: Liquid Crystal Polymer (LCP), Glass Filled; Features: Board Guide; Operating Temperature: -; Ingress Protection: -; Insulation Color: Black; Current Rating: -; Voltage Rating: -; Mated Stacking Heights: -; Contact Finish Thickness - Post: -; Applications: General Purpose, Medical, Military, Telecommunications; ComponentLink1URL: https://www.molex.com/pdm_docs/sd/430451227_sd.pdf; ComponentLink1Description: https://www.molex.com/pdm_docs/sd/430451227_sd.pdf; Supplier Part Number 1: WM10697-ND
P4 = CONN 14POS MICRO-FIT 3mm: Connector Header Through Hole 14 position 0.118" (3.00mm); Manufacturer: Molex, LLC; Manufacturer Part Number: 0430451427; Number of Positions: 14; Number of Positions Loaded: All; Style: Board to Cable/Wire; Shrouding: Shrouded - 4 Wall; Contact Length - Post: 0.125" (3.18mm); Material Flammability Rating: UL94 V-0; Supplier 1: Digi-Key; RoHS: RoHS Compliant; Category: Connectors, Interconnects; Stock 1: 829; Pricing 1: 1=4.57, 10=4.377, 25=4.0124, 50=3.8296, 100=3.6473, 250=3.1914, 936=2.82666, 1872=2.5531, 2808=2.46192 (CAD); Packaging: Tray; Part Status: Active; Connector Type: Header; Contact Type: Male Pin; Pitch - Mating: 0.118" (3.00mm); Number of Rows: 2; Row Spacing - Mating: 0.118" (3.00mm); Mounting Type: Through Hole; Termination: Solder; Fastening Type: Locking Ramp; Contact Length - Mating: -; Overall Contact Length: -; Insulation Height: 0.390" (9.91mm); Contact Shape: Square; Contact Finish - Mating: Tin; Contact Finish Thickness - Mating: 60.0µin (1.52µm); Contact Finish - Post: Tin; Contact Material: Brass; Insulation Material: Liquid Crystal Polymer (LCP), Glass Filled; Features: Board Guide; Operating Temperature: -; Ingress Protection: -; Insulation Color: Black; Current Rating: -; Voltage Rating: -; Mated Stacking Heights: -; Contact Finish Thickness - Post: -; Applications: General Purpose, Medical, Military, Telecommunications; ComponentLink1URL: https://www.molex.com/pdm_docs/sd/430451427_sd.pdf; ComponentLink1Description: https://www.molex.com/pdm_docs/sd/430451427_sd.pdf; Supplier Part Number 1: WM10707-ND
P5 P6 = CONN 2POS DURA-CLIK 0.079" VERT: 2 Positions Header, Shrouded Connector 0.079" (2.00mm) Surface Mount, Vertical Tin; Manufacturer: Molex, LLC; Manufacturer Part Number: 5600200220; Style: Board to Cable/Wire; Shrouding: Shrouded - 4 Wall; Number of Positions: 2; Number of Positions Loaded: All; Mated Stacking Heights: 9.3mm; Supplier 1: Digi-Key; RoHS: RoHS Compliant; Category: Connectors, Interconnects; Stock 1: 11912; Pricing 1: 1=1.16, 10=1.012, 25=0.952, 50=0.9122, 100=0.8727, 250=0.79336 (CAD); Packaging: Cut Tape (CT); Part Status: Active; Connector Type: Header; Contact Type: Male Pin; Pitch - Mating: 0.079" (2.00mm); Number of Rows: 1; Row Spacing - Mating: -; Mounting Type: Surface Mount; Termination: Solder; Fastening Type: Latch Lock; Contact Length - Mating: -; Contact Length - Post: -; Overall Contact Length: -; Insulation Height: 0.315" (8.00mm); Contact Shape: Square; Contact Finish - Mating: Tin; Contact Finish Thickness - Mating: -; Contact Finish - Post: Tin; Contact Material: Copper Alloy; Insulation Material: Polyamide (PA), Nylon; Features: Solder Retention; Operating Temperature: -; Ingress Protection: -; Material Flammability Rating: -; Insulation Color: Natural; Current Rating: -; Voltage Rating: -; Contact Finish Thickness - Post: -; Applications: Automotive, Industrial; ComponentLink1URL: http://www.molex.com/pdm_docs/sd/5600200220_sd.pdf; ComponentLink1Description: http://www.molex.com/pdm_docs/sd/5600200220_sd.pdf; Supplier Part Number 1: WM10862CT-ND
P7 = CONN 5POS HEADR MALE 0.1in: 5 Positions Header, Breakaway Connector 0.100" (2.54mm) Through Hole Tin; Manufacturer 1: Molex; Manufacturer Part Number 1: 0022284050; Description 1: Conn Unshrouded Header HDR 5 POS 2.54mm Solder ST Thru-Hole KK® Bag; Contact Resistance: 20mR; Number of Positions: 5; Gender: Male; Connector Type: Male Pin; Max Voltage Rating (AC): 250V; Supplier 1: Digi-Key; Supplier Part Number 1: WM50014-05-ND; Stock 1: 3161; Pricing 1: 1=0.22, 10=0.21, 25=0.1796, 50=0.157, 100=0.1459, 250=0.129, 500=0.1234 (USD); Mount: Through Hole; Colour: Black; Contact Plating: Nickel,Tin; Contact Material: Bronze,Brass; Housing Colour: Black; Housing Material: Nylon; Min Operating Temperature: 0°C; Max Operating Temperature: 75°C; Packaging: Bulk; Number of Rows: 1; Termination: Solder; Number of Contacts: 5; Orientation: Straight; Max Voltage Rating (DC): 250V; Length: 12.7mm; Pitch: 2.54mm; Depth: 2.49mm; Contact Mating Length: 0.24inch; ComponentLink1URL: https://datasheet.ciiva.com/6814/022284363-sd-6814049.pdf; ComponentLink1Description: https://datasheet.ciiva.com/6814/022284363-sd-6814049.pdf; ComponentLink2URL: https://datasheet.ciiva.com/14804/179390022284050-pcb-headers-14804361.pdf; ComponentLink2Description: https://datasheet.ciiva.com/14804/179390022284050-pcb-headers-14804361.pdf; ComponentLink3URL: https://datasheet.ciiva.com/15217/getdatasheetpartid-256138-15217709.pdf; ComponentLink3Description: https://datasheet.ciiva.com/15217/getdatasheetpartid-256138-15217709.pdf
P8 P9 = CONN 2POS MICRO-FIT 3mm: Connector Header Through Hole 2 position; Manufacturer: Molex; Manufacturer Part Number: 43045-0227; Number of Positions: 2; Gender: Male; Contact Resistance: 10mR; Number of Ports: 1; Max Voltage Rating (DC): 250.25kV; Current Rating: 5A; Voltage Rating: 600V; Glow Wire Compliant: Compliant; Supplier 1: Digi-Key; Stock 1: 3657; Pricing 1: 1=0.84, 10=0.74, 25=0.6968, 50=0.6676, 100=0.6387, 250=0.5806, 500=0.52254, 1000=0.46448, 2500=0.42094 (USD); Mount: Through Hole; Contact Plating: Tin; Contact Material: Brass; Housing Colour: Black; Housing Material: Thermoplastic; Number of Terminals: 2; Min Operating Temperature: -40°C; Max Operating Temperature: 105°C; Number of Rows: 2; Packaging: Tray; Termination: Solder; Number of Contacts: 2; Orientation: Vertical; Package Quantity: 3168; Number of Circuits: 2; Length: 7.15mm; Pitch: 3mm; Depth: 8.77mm; Row Spacing: 3mm; Radiation Hardening: No; Halogen Free: Low Halogen; ComponentLink1URL: http://www.onlinecomponents.com/productFiles/mf-MOL/307170430450227_pcb_headers.pdf; ComponentLink1Description: http://www.onlinecomponents.com/productFiles/mf-MOL/307170430450227_pcb_headers.pdf; ComponentLink2URL: http://www.mouser.com/ds/2/276/0430450227_PCB_HEADERS-142611.pdf; ComponentLink2Description: http://www.mouser.com/ds/2/276/0430450227_PCB_HEADERS-142611.pdf; ComponentLink3URL: http://uk.rs-online.com/webdocs/13c3/0900766b813c3a46.pdf; ComponentLink3Description: http://uk.rs-online.com/webdocs/13c3/0900766b813c3a46.pdf; ComponentLink4URL: http://www.molex.com/webdocs/datasheets/pdf/en-us/0430450227_PCB_HEADERS.pdf; ComponentLink4Description: http://www.molex.com/webdocs/datasheets/pdf/en-us/0430450227_PCB_HEADERS.pdf; Supplier Part Number 1: WM10657-ND

## Sheet BMS AFE - Regulator.SchDoc: Title
size B; Organization: Midnight Sun Solar Rayce Car Team; Address1: University of Waterloo; Address2: 200 University Ave W; Address3: Waterloo, ON, Canada; Address4: N2L 3E9; Website: www.uwmidsun.com; ProjectName: ProjectName
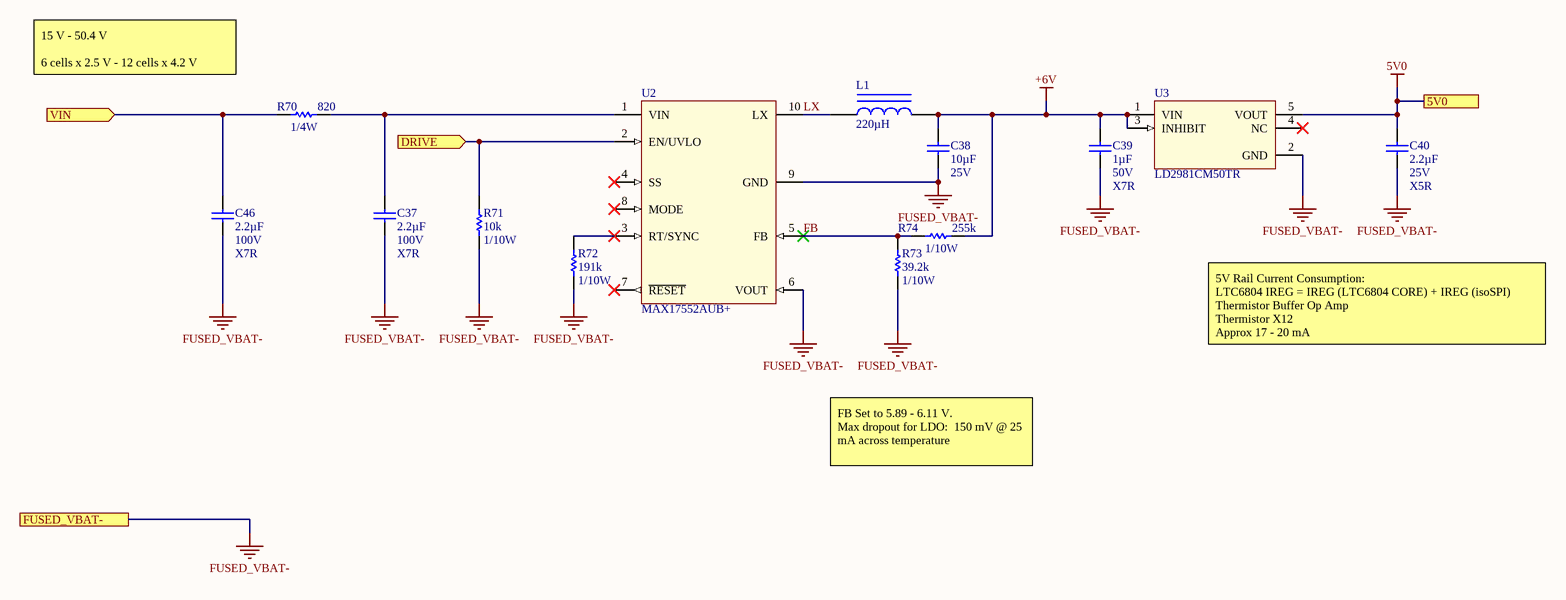
[diagram p7: BMS AFE - Regulator.SchDoc]

### Parts
C37  Capacitance: 2.2µF  Voltage: 100V  Temperature Coefficient: X7R  [CAP, 1206]  (hidden comment: CAP CER 2.2UF 100V ±20% X7R 1206)
C38  Capacitance: 10µF  Voltage - Rated: 25V  [CAP, 0805]  (hidden comment: CAP CER 10uF 25V 10% X5R 0805)
C39  Capacitance: 1µF  Voltage: 50V  Temperature Coefficient: X7R  [CAP, 0603]  (hidden comment: CAP CER 1UF 50V 10% X7R 0603)
C40  Capacitance: 2.2µF  Voltage: 25V  Temperature Coefficient: X5R  [CAP, 0603]  (hidden comment: CAP CER 2.2UF 25V 10% X5R 0603)
C46  Capacitance: 2.2µF  Voltage: 100V  Temperature Coefficient: X7R  [CAP, 1206]  (hidden comment: CAP CER 2.2UF 100V ±20% X7R 1206)
L1  Inductance: 220µH  [INDP6060X23N]  (hidden comment: IND 220uH 0.59A 20%)
R70  Resistance: 820  Power: 1/4W  [RES, 0603]  (hidden comment: RES 820 OHM 5% 1/4W 0603)
R71  Resistance: 10k  Power: 1/10W  [RES, 0603]  (hidden comment: RES 10K OHM 1% 1/10W 0603)
R72  Resistance: 191k  Power: 1/10W  [RES, 0603]  (hidden comment: RES 191K OHM 1% 1/10W 0603)
R73  Resistance: 39.2k  Power: 1/10W  [RES, 0603]  (hidden comment: RES 39.2K OHM 1% 1/10W 0603)
R74  Resistance (Ohms): 255k  Power (Watts): 1/10W  [RES, 0603]  (hidden comment: RES 255K OHM 1% 1/10W 0603)
U2  Manufacturer Part Number 1: MAX17552AUB+  [TSSOP50P490X110-10N]  (hidden comment: IC REG BUCK ADJ 0.1A 10UMAX)
U3  Manufacturer Part Number 1: LD2981CM50TR  [SOT95P280X145-5N]  (hidden comment: IC REG LDO 5V 0.1A SOT23-5)

### Ports
5V0, DRIVE (in), FUSED_VBAT-, VIN (in)

### Nets
5V0: C40.1 U3.5(VOUT) ; port 5V0
+6V: C38.1 C39.1 L1.2 R74.2 U3.1(VIN) U3.3(INHIBIT)
FUSED_VBAT+: C46.1 R70.1 ; port VIN
FUSED_VBAT-: C37.2 C38.2 C39.2 C40.2 C46.2 R71.2 R72.2 R73.2 U2.6(VOUT) U2.9(GND) U3.2(GND) ; port FUSED_VBAT-
FB: R73.1 R74.1 U2.5(FB)
LX: L1.1 U2.10(LX)
NetC37_1: C37.1 R70.2 U2.1(VIN)
NetR71_1: R71.1 U2.2(EN/UVLO) ; port DRIVE
NetR72_1: R72.1 U2.3(RT/SYNC)

Not connected (* = marked no-connect by the designer): U2 4(SS)* 7(~{RESET})* 8(MODE)*; U3 4(NC)*

### Notes on the sheet
- 15 V - 50.4 V
  6 cells x 2.5 V - 12 cells x 4.2 V
- 5V Rail Current Consumption:
  LTC6804 IREG = IREG (LTC6804 CORE) + IREG (isoSPI)
  Thermistor Buffer Op Amp
  Thermistor X12
  Approx 17 - 20 mA
- FB Set to 5.89 - 6.11 V.
  Max dropout for LDO:  150 mV @ 25 mA across temperature
- PROJECT
- DOCUMENT
- DRAWN BY
- LAST MODIFIED
- PART NUMBER
- REVISION
- SHEET
- VARIANT
- OF
- Engineering 5 - 1002
  University of Waterloo
  (519) 888-4567 x32978
  hardware@uwmidsun.com

### Library data of the parts
C37 C46 = CAP CER 2.2UF 100V ±20% X7R 1206: 2.2µF ±20% 100V Ceramic Capacitor X7R 1206 (3216 Metric); Manufacturer 1: Murata Electronics North America; Manufacturer Part Number 1: GRM31CR72A225MA73L; Supplier 1: Digi-Key; Supplier Part Number 1: 490-12773-1-ND; Packaging: Cut Tape (CT); Part Status: Active; Operating Temperature: -55°C ~ 125°C; Ratings: -; Mounting Type: Surface Mount, MLCC; Package / Case: 1206 (3216 Metric); Size / Dimension: 0.126" L x 0.063" W (3.20mm x 1.60mm); Height - Seated (Max): -; Thickness (Max): 0.071" (1.80mm); Lead Spacing: -; Lead Style: -; ComponentLink1URL: http://www.murata.com/~/media/webrenewal/support/library/catalog/products/capacitor/mlcc/c02e.ashx; ComponentLink1Description: http://www.murata.com/~/media/webrenewal/support/library/catalog/products/capacitor/mlcc/c02e.ashx; Tolerance: ±20%
C38 = CAP CER 10uF 25V 10% X5R 0805: 10µF ±10% 25V Ceramic Capacitor X5R 0805 (2012 Metric); Manufacturer: Murata Electronics North America; Manufacturer Part Number: GRM21BR61E106KA73L; Supplier 1: Digi-Key; Supplier Part Number 1: 490-5523-1-ND; Packaging: Cut Tape (CT); Part Status: Active; Operating Temperature: -55°C ~ 85°C; Ratings: -; Mounting Type: Surface Mount, MLCC; Package / Case: 0805 (2012 Metric); Size / Dimension: 0.079" L x 0.049" W (2.00mm x 1.25mm); Height - Seated (Max): -; Thickness (Max): 0.053" (1.35mm); Lead Spacing: -; Lead Style: -; ComponentLink1URL: http://search.murata.co.jp/Ceramy/image/img/A01X/G101/ENG/GRM21BR61E106KA73-01.pdf; ComponentLink1Description: http://search.murata.co.jp/Ceramy/image/img/A01X/G101/ENG/GRM21BR61E106KA73-01.pdf; Tolerance: ±10%; Temperature Coefficient: X5R; RoHS: RoHS Compliant; Category: Capacitors; Stock 1: 1695157; Features: -; Applications: General Purpose; Pricing 1: 1=0.3, 10=0.214, 100=0.1008, 500=0.07068, 1000=0.05851 (CAD)
C39 = CAP CER 1UF 50V 10% X7R 0603: 1µF ±10% 50V Ceramic Capacitor X7R 0603 (1608 Metric); Manufacturer 1: Taiyo Yuden; Manufacturer Part Number 1: UMK107AB7105KA-T; Supplier 1: Digi-Key; Supplier Part Number 1: 587-3247-1-ND; Packaging: Cut Tape (CT); Part Status: Active; Operating Temperature: -55°C ~ 125°C; Ratings: -; Mounting Type: Surface Mount, MLCC; Package / Case: 0603 (1608 Metric); Size / Dimension: 0.063" L x 0.031" W (1.60mm x 0.80mm); Height - Seated (Max): -; Thickness (Max): 0.037" (0.95mm); Lead Spacing: -; Lead Style: -; ComponentLink1URL: http://www.yuden.co.jp/productdata/catalog/en/mlcc_all_e.pdf; ComponentLink1Description: http://www.yuden.co.jp/productdata/catalog/en/mlcc_all_e.pdf; Tolerance: ±10%
C40 = CAP CER 2.2UF 25V 10% X5R 0603: 2.2µF ±10% 25V Ceramic Capacitor X5R 0603 (1608 Metric); Manufacturer 1: Murata Electronics North America; Manufacturer Part Number 1: GRM188R61E225KA12D; Supplier 1: Digi-Key; Supplier Part Number 1: 490-10731-1-ND; Packaging: Cut Tape (CT); Part Status: Active; Operating Temperature: -55°C ~ 85°C; Ratings: -; Mounting Type: Surface Mount, MLCC; Package / Case: 0603 (1608 Metric); Size / Dimension: 0.063" L x 0.031" W (1.60mm x 0.80mm); Height - Seated (Max): -; Thickness (Max): 0.035" (0.90mm); Lead Spacing: -; Lead Style: -; ComponentLink1URL: http://www.murata.com/~/media/webrenewal/support/library/catalog/products/capacitor/mlcc/c02e.ashx; ComponentLink1Description: http://www.murata.com/~/media/webrenewal/support/library/catalog/products/capacitor/mlcc/c02e.ashx; Tolerance: ±10%
L1 = IND 220uH 0.59A 20%: 220µH Shielded Inductor 590mA 834 mOhm Nonstandard; Manufacturer 1: Laird-Signal Integrity Products; Manufacturer Part Number 1: TYS6045221M-10; Current - Saturation: 700mA; Frequency - Self Resonant: 3.5MHz; Supplier 1: Digi-Key; Supplier Part Number 1: 240-2742-1-ND; Packaging: Cut Tape (CT); Part Status: Active; Type: -; Material - Core: -; Current Rating: 590mA; Shielding: Shielded; DC Resistance (DCR): 834 mOhm; Q @ Freq: -; Ratings: AEC-Q200; Operating Temperature: -40°C ~ 125°C; Mounting Type: Surface Mount; Package / Case: Nonstandard; Supplier Device Package: -; Size / Dimension: 0.236" L x 0.236" W (6.00mm x 6.00mm); Height - Seated (Max): 0.185" (4.70mm); ComponentLink1URL: http://assets.lairdtech.com/home/brandworld/files/TYS6045221M-10.pdf; ComponentLink1Description: http://assets.lairdtech.com/home/brandworld/files/TYS6045221M-10.pdf; Tolerance: ±20%
R70 = RES 820 OHM 5% 1/4W 0603: RES SMD 820 OHM 5% 1/4W 0603; Manufacturer 1: Rohm Semiconductor; Manufacturer Part Number 1: ESR03EZPJ821; Temperature Coefficient: ±200ppm/°C; Supplier 1: Digi-Key; Supplier Part Number 1: RHM820DCT-ND; Packaging: Cut Tape (CT); Part Status: Active; Composition: Thick Film; Operating Temperature: -55°C ~ 155°C; Package / Case: 0603 (1608 Metric); Supplier Device Package: 0603; Size / Dimension: 0.063" L x 0.031" W (1.60mm x 0.80mm); Height - Seated (Max): 0.022" (0.55mm); Failure Rate: -; ComponentLink1URL: http://www.rohm.com/web/global/datasheet/ESR01MZPF/esr-e; ComponentLink1Description: http://www.rohm.com/web/global/datasheet/ESR01MZPF/esr-e; Tolerance: ±5%
R71 = RES 10K OHM 1% 1/10W 0603: RES SMD 10K OHM 1% 1/10W 0603; Manufacturer 1: Yageo; Manufacturer Part Number 1: RC0603FR-0710KL; Temperature Coefficient: ±100ppm/°C; Supplier 1: Digi-Key; Supplier Part Number 1: 311-10.0KHRCT-ND; Packaging: Cut Tape (CT); Part Status: Active; Composition: Thick Film; Operating Temperature: -55°C ~ 155°C; Package / Case: 0603 (1608 Metric); Supplier Device Package: 0603; Size / Dimension: 0.063" L x 0.031" W (1.60mm x 0.80mm); Height - Seated (Max): 0.022" (0.55mm); Failure Rate: -; ComponentLink1URL: http://www.yageo.com/documents/recent/PYu-RC_Group_51_RoHS_L_7.pdf; ComponentLink1Description: http://www.yageo.com/documents/recent/PYu-RC_Group_51_RoHS_L_7.pdf; Tolerance: ±1%
R72 = RES 191K OHM 1% 1/10W 0603: 191k Ohm ±1% 0.1W, 1/10W Chip Resistor 0603 (1608 Metric) Moisture Resistant Thick Film; Manufacturer 1: Yageo; Manufacturer Part Number 1: RC0603FR-07191KL; Temperature Coefficient: ±100ppm/°C; Supplier 1: Digi-Key; Supplier Part Number 1: 311-191KHRCT-ND; Packaging: Cut Tape (CT); Part Status: Active; Composition: Thick Film; Operating Temperature: -55°C ~ 155°C; Package / Case: 0603 (1608 Metric); Supplier Device Package: 0603; Size / Dimension: 0.063" L x 0.031" W (1.60mm x 0.80mm); Height - Seated (Max): 0.022" (0.55mm); Failure Rate: -; ComponentLink1URL: http://www.yageo.com/documents/recent/PYu-RC_Group_51_RoHS_L_7.pdf; ComponentLink1Description: http://www.yageo.com/documents/recent/PYu-RC_Group_51_RoHS_L_7.pdf; Tolerance: ±1%
R73 = RES 39.2K OHM 1% 1/10W 0603: 39.2k Ohm ±1% 0.1W, 1/10W Chip Resistor 0603 (1608 Metric) Moisture Resistant Thick Film; Manufacturer 1: Yageo; Manufacturer Part Number 1: RC0603FR-0739K2L; Temperature Coefficient: ±100ppm/°C; Supplier 1: Digi-Key; Supplier Part Number 1: 311-39.2KHRCT-ND; Packaging: Cut Tape (CT); Part Status: Active; Composition: Thick Film; Operating Temperature: -55°C ~ 155°C; Package / Case: 0603 (1608 Metric); Supplier Device Package: 0603; Size / Dimension: 0.063" L x 0.031" W (1.60mm x 0.80mm); Height - Seated (Max): 0.022" (0.55mm); Failure Rate: -; ComponentLink1URL: http://www.yageo.com/documents/recent/PYu-RC_Group_51_RoHS_L_7.pdf; ComponentLink1Description: http://www.yageo.com/documents/recent/PYu-RC_Group_51_RoHS_L_7.pdf; Tolerance: ±1%
R74 = RES 255K OHM 1% 1/10W 0603: 255k Ohm ±1% 0.1W, 1/10W Chip Resistor 0603 (1608 Metric) Moisture Resistant Thick Film; Manufacturer 1: Yageo; Manufacturer Part Number 1: RC0603FR-07255KL; Description 1: RES SMD 255K OHM 1% 1/10W 0603; Temperature Coefficient: ±100ppm/°C; Supplier 1: Digi-Key; Supplier Part Number 1: 311-255KHRCT-ND; RoHS: RoHS Compliant; Category: Resistors; Stock 1: 106564; Pricing 1: 1=0.16, 10=0.022, 100=0.0089, 1000=0.00402, 2500=0.00349 (CAD); Packaging: Cut Tape (CT); Part Status: Active; Composition: Thick Film; Features: Moisture Resistant; Operating Temperature: -55°C ~ 155°C; Package / Case: 0603 (1608 Metric); Supplier Device Package: 0603; Size / Dimension: 0.063" L x 0.031" W (1.60mm x 0.80mm); Height - Seated (Max): 0.022" (0.55mm); Failure Rate: -; ComponentLink1URL: http://www.yageo.com/documents/recent/PYu-RC_Group_51_RoHS_L_7.pdf; ComponentLink1Description: http://www.yageo.com/documents/recent/PYu-RC_Group_51_RoHS_L_7.pdf; Tolerance: ±1%
U2 = IC REG BUCK ADJ 0.1A 10UMAX: Buck Switching Regulator IC Positive Adjustable 0.8V 1 Output 100mA 10-TFSOP, 10-MSOP (0.118", 3.00mm Width); Manufacturer 1: Maxim Integrated; Function: Step-Down; Number of Outputs: 1; Voltage - Input (Min): 4V; Voltage - Input (Max): 60V; Voltage - Output (Max): 54V; Frequency - Switching: 100kHz ~ 2.2MHz; Synchronous Rectifier: Yes; Supplier 1: Digi-Key; Supplier Part Number 1: MAX17552AUB+-ND; Packaging: Tube; Part Status: Active; Output Configuration: Positive; Topology: Buck; Output Type: Adjustable; Voltage - Output (Min/Fixed): 0.8V; Current - Output: 100mA; Operating Temperature: -40°C ~ 125°C (TJ); Mounting Type: Surface Mount; Package / Case: 10-TFSOP, 10-MSOP (0.118", 3.00mm Width); Supplier Device Package: 10-uMAX; ComponentLink1URL: http://datasheets.maximintegrated.com/en/ds/MAX17552.pdf; ComponentLink1Description: http://datasheets.maximintegrated.com/en/ds/MAX17552.pdf
U3 = IC REG LDO 5V 0.1A SOT23-5: Linear Voltage Regulator IC Positive Fixed Output 5V 100mA SOT-23-5; Manufacturer 1: STMicroelectronics; Voltage - Dropout (Typical): 0.18V @ 100mA; Voltage - Input: Up to 16V; Supplier 1: Digi-Key; Supplier Part Number 1: 497-7787-1-ND; Packaging: Cut Tape (CT); Part Status: Active; Regulator Topology: Positive Fixed; Voltage - Output: 5V; Current - Output: 100mA; Current - Limit (Min): -; Operating Temperature: -40°C ~ 125°C; Mounting Type: Surface Mount; Package / Case: SC-74A, SOT-753; Supplier Device Package: SOT-23-5; ComponentLink1URL: http://www.st.com/content/ccc/resource/technical/document/datasheet/group1/b7/b5/a1/83/9c/bd/4a/90/CD00001635/files/CD00001635.pdf/jcr:content/translations/en.CD00001635.pdf; ComponentLink1Description: http://www.st.com/content/ccc/resource/technical/document/datasheet/group1/b7/b5/a1/83/9c/bd/4a/90/CD00001635/files/CD00001635.pdf/jcr:content/translations/en.CD00001635.pdf